# Altium project BLE LED controller.PrjPCB
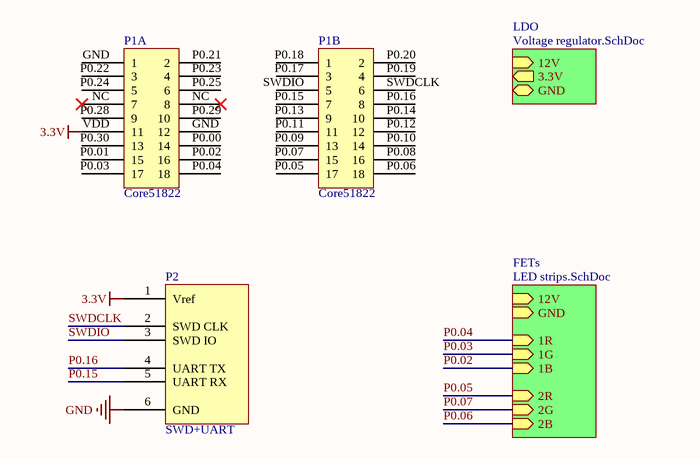
[diagram p0: Top.SchDoc]
3 sheets, 13 parts. Net scope: hierarchical (ports join the sheet entries above them; power ports are global).
Board file: BLE LED controller.PcbDoc
Sheets:
  Top.SchDoc
    LDO = Voltage regulator.SchDoc
    FETs = LED strips.SchDoc

## Sheet Top.SchDoc
size A4

### Parts
P1  Core51822  (parts A,B of 2)
P2  SWD+UART

### Sub-sheets
FETs = LED strips.SchDoc: 1B (in), 12V (in), 2R (in), 1R (in), 2G (in), 1G (in), 2B (in), GND (in)
LDO = Voltage regulator.SchDoc: 3.3V (out), 12V (in), GND (bidir)

### Nets
3.3V: P1.VDD(11) P2.1(Vref)
GND: P2.6(GND) ; sheet FETs/GND
P0.15: P2.5(UART_RX)
P0.16: P2.4(UART_TX)
SWDCLK: P2.2(SWD_CLK)
SWDIO: P2.3(SWD_IO)

Not connected (* = marked no-connect by the designer): P1 GND(1) NC(7)* P0.00(14) P0.01(15) P0.02(16) P0.03(17) P0.04(18) P0.05(17) P0.06(18) P0.07(15) P0.08(16) P0.09(13) P0.10(14) P0.11(11) P0.12(12) P0.13(9) P0.14(10) P0.15(7) P0.16(8) P0.17(3) P0.18(1) P0.19(4) P0.20(2) P0.21(2) P0.22(3) P0.23(4) P0.24(5) P0.25(6) P0.28(9) P0.29(10) P0.30(13) SWDCLK(6) SWDIO(5)

## Sheet Voltage regulator.SchDoc
size A4
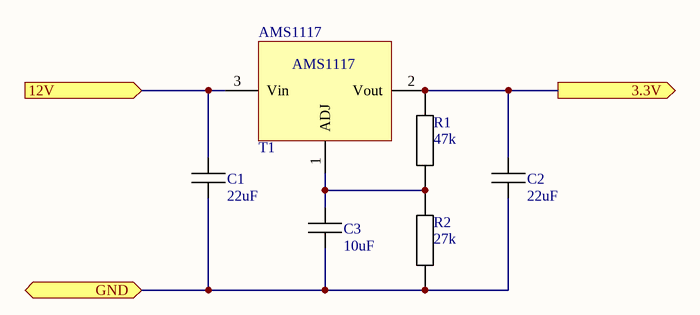
[diagram p1: Voltage regulator.SchDoc]

### Parts
AMS1117  T1
C1  22uF  [0805-C]
C2  22uF  [0805-C]
C3  10uF  [0805-C]
R1  47k  [0805-R]
R2  27k  [0805-R]

### Ports
3.3V (out), 12V (in), GND (bidir)

### Nets
NetAMS1117_1: AMS1117.1(ADJ) C3.2 R1.1 R2.2
NetAMS1117_2: AMS1117.2(Vout) C2.2 R1.2 ; port 3.3V
NetAMS1117_3: AMS1117.3(Vin) C1.2 ; port 12V
NetC1_1: C1.1 C2.1 C3.1 R2.1 ; port GND

### Library data of the parts
AMS1117 = AMS1117
C1-C3 = Capacitor
R1 R2 = Resistor

## Sheet LED strips.SchDoc
size A4
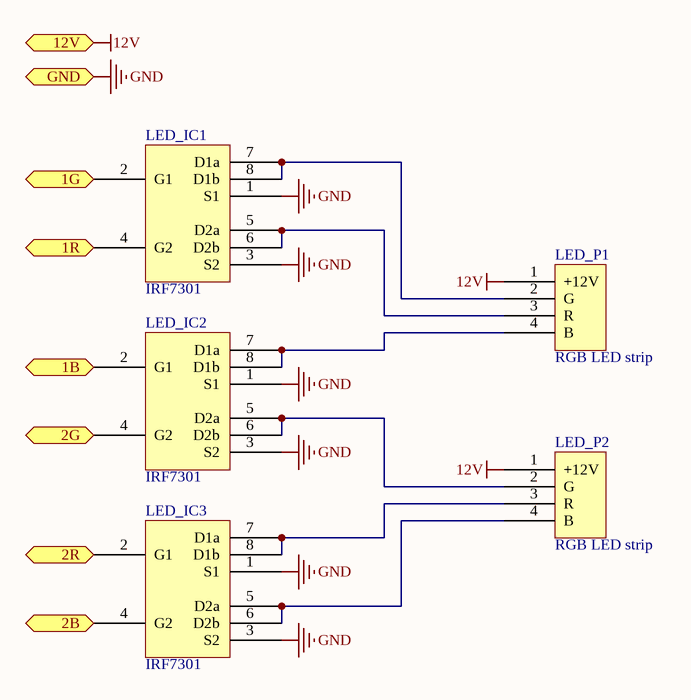
[diagram p2: LED strips.SchDoc]

### Parts
LED_IC1  IRF7301  [SOIC8]
LED_IC2  IRF7301  [SOIC8]
LED_IC3  IRF7301  [SOIC8]
LED_P1  RGB LED strip
LED_P2  RGB LED strip

### Ports
1B (in), 1G (in), 1R (in), 2B (in), 2G (in), 2R (in), 12V (in), GND (in)

### Nets
12V: LED_P1.1(+12V) LED_P2.1(+12V) ; port 12V
GND: LED_IC1.1(S1) LED_IC1.3(S2) LED_IC2.1(S1) LED_IC2.3(S2) LED_IC3.1(S1) LED_IC3.3(S2) ; port GND
P0.02: LED_IC2.2(G1) ; port 1B
P0.03: LED_IC1.2(G1) ; port 1G
P0.04: LED_IC1.4(G2) ; port 1R
P0.05: LED_IC3.2(G1) ; port 2R
P0.06: LED_IC3.4(G2) ; port 2B
P0.07: LED_IC2.4(G2) ; port 2G
NetLED_IC1_5: LED_IC1.5(D2a) LED_IC1.6(D2b) LED_P1.3(R)
NetLED_IC1_7: LED_IC1.7(D1a) LED_IC1.8(D1b) LED_P1.2(G)
NetLED_IC2_5: LED_IC2.5(D2a) LED_IC2.6(D2b) LED_P2.2(G)
NetLED_IC2_7: LED_IC2.7(D1a) LED_IC2.8(D1b) LED_P1.4(B)
NetLED_IC3_5: LED_IC3.5(D2a) LED_IC3.6(D2b) LED_P2.4(B)
NetLED_IC3_7: LED_IC3.7(D1a) LED_IC3.8(D1b) LED_P2.3(R)

## Nets that join several sheets
GND: Top (P2.6), LED strips (6 pins)